# Altium schematic sheet Connectors.SchDoc
size 431 x 279 mm; SheetNumber: 1; SheetTotal: 1
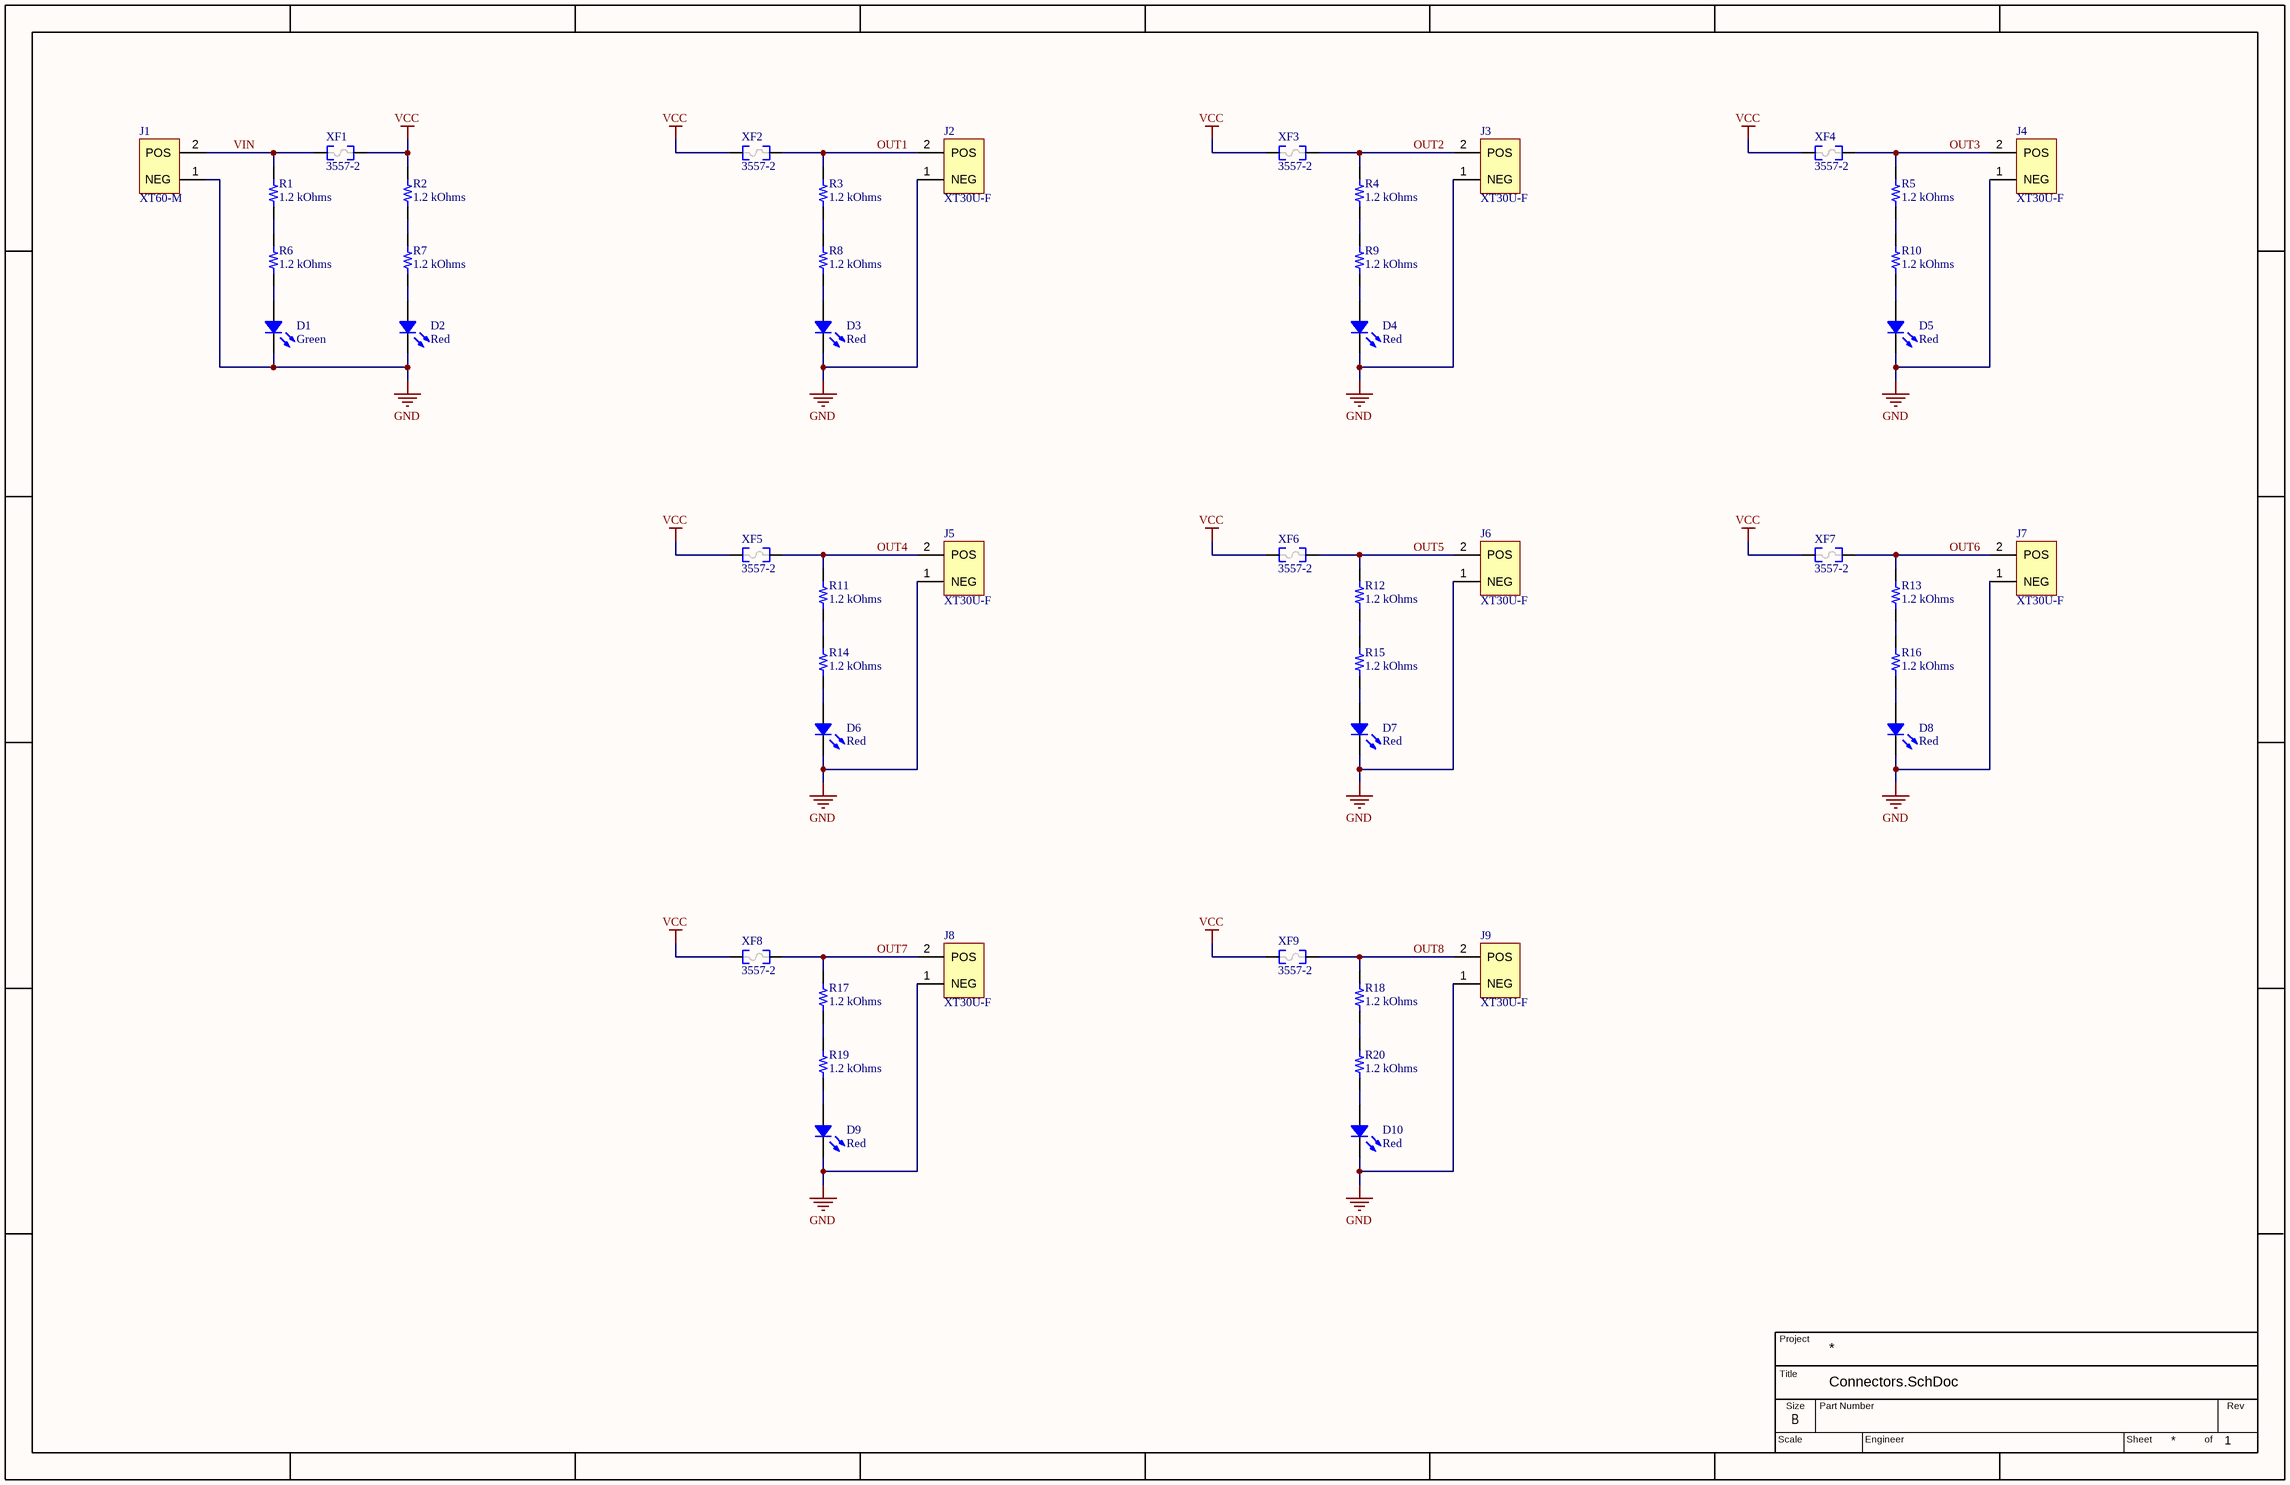
[diagram p0: Connectors.SchDoc]

## Parts
D1  Green  [LED 0603_1608 GREEN]
D2  Red  [LED 0603_1608 RED]
D3  Red  [LED 0603_1608 RED]
D4  Red  [LED 0603_1608 RED]
D5  Red  [LED 0603_1608 RED]
D6  Red  [LED 0603_1608 RED]
D7  Red  [LED 0603_1608 RED]
D8  Red  [LED 0603_1608 RED]
D9  Red  [LED 0603_1608 RED]
D10  Red  [LED 0603_1608 RED]
J1  XT60-M  [AMASS_XT60-M]
J2  XT30U-F  [AMASS_XT30-M]
J3  XT30U-F  [AMASS_XT30-M]
J4  XT30U-F  [AMASS_XT30-M]
J5  XT30U-F  [AMASS_XT30-M]
J6  XT30U-F  [AMASS_XT30-M]
J7  XT30U-F  [AMASS_XT30-M]
J8  XT30U-F  [AMASS_XT30-M]
J9  XT30U-F  [AMASS_XT30-M]
R1  1.2 kOhms  [RES 1210_3225]
R2  1.2 kOhms  [RES 1210_3225]
R3  1.2 kOhms  [RES 1210_3225]
R4  1.2 kOhms  [RES 1210_3225]
R5  1.2 kOhms  [RES 1210_3225]
R6  1.2 kOhms  [RES 1210_3225]
R7  1.2 kOhms  [RES 1210_3225]
R8  1.2 kOhms  [RES 1210_3225]
R9  1.2 kOhms  [RES 1210_3225]
R10  1.2 kOhms  [RES 1210_3225]
R11  1.2 kOhms  [RES 1210_3225]
R12  1.2 kOhms  [RES 1210_3225]
R13  1.2 kOhms  [RES 1210_3225]
R14  1.2 kOhms  [RES 1210_3225]
R15  1.2 kOhms  [RES 1210_3225]
R16  1.2 kOhms  [RES 1210_3225]
R17  1.2 kOhms  [RES 1210_3225]
R18  1.2 kOhms  [RES 1210_3225]
R19  1.2 kOhms  [RES 1210_3225]
R20  1.2 kOhms  [RES 1210_3225]
XF1  3557-2  [FUSE_3557-2]
XF2  3557-2  [FUSE_3557-2]
XF3  3557-2  [FUSE_3557-2]
XF4  3557-2  [FUSE_3557-2]
XF5  3557-2  [FUSE_3557-2]
XF6  3557-2  [FUSE_3557-2]
XF7  3557-2  [FUSE_3557-2]
XF8  3557-2  [FUSE_3557-2]
XF9  3557-2  [FUSE_3557-2]

## Nets
GND: D1.2 D2.2 D3.2 D4.2 D5.2 D6.2 D7.2 D8.2 D9.2 D10.2 J1.1(NEG) J2.1(NEG) J3.1(NEG) J4.1(NEG) J5.1(NEG) J6.1(NEG) J7.1(NEG) J8.1(NEG) J9.1(NEG)
VCC: R2.2 XF1.2 XF2.1 XF3.1 XF4.1 XF5.1 XF6.1 XF7.1 XF8.1 XF9.1
OUT1: J2.2(POS) R3.2 XF2.2
OUT2: J3.2(POS) R4.2 XF3.2
OUT3: J4.2(POS) R5.2 XF4.2
OUT4: J5.2(POS) R11.2 XF5.2
OUT5: J6.2(POS) R12.2 XF6.2
OUT6: J7.2(POS) R13.2 XF7.2
OUT7: J8.2(POS) R17.2 XF8.2
OUT8: J9.2(POS) R18.2 XF9.2
VIN: J1.2(POS) R1.2 XF1.1
NetD1_1: D1.1 R6.1
NetD2_1: D2.1 R7.1
NetD3_1: D3.1 R8.1
NetD4_1: D4.1 R9.1
NetD5_1: D5.1 R10.1
NetD6_1: D6.1 R14.1
NetD7_1: D7.1 R15.1
NetD8_1: D8.1 R16.1
NetD9_1: D9.1 R19.1
NetD10_1: D10.1 R20.1
NetR1_1: R1.1 R6.2
NetR2_1: R2.1 R7.2
NetR3_1: R3.1 R8.2
NetR4_1: R4.1 R9.2
NetR5_1: R5.1 R10.2
NetR11_1: R11.1 R14.2
NetR12_1: R12.1 R15.2
NetR13_1: R13.1 R16.2
NetR17_1: R17.1 R19.2
NetR18_1: R18.1 R20.2

## Notes on the sheet
- Title
- Project
- Scale
- Size
- B
- Part Number
- Engineer
- Sheet
- of
- Rev

## Library data of the parts
D1 = LTST-C193TGKT-5A: LED GREEN CLEAR CHIP SMD; Manufacturer: Lite-On Inc.; Configuration: Standard; Current - Test: 5mA; Lens Color: Colorless; Lens Size: 1.15mm x 0.80mm; Lens Style: Rectangle with Flat Top; Millicandela Rating: 154mcd; Viewing Angle: 130°; Voltage - Forward (Vf) (Typ): 2.8V; Wavelength - Dominant: 528nm; Wavelength - Peak: 525nm; Part Number: LTST-C193TGKT-5A; Color: Green; ComponentLink1Description: Datasheet; ComponentLink1URL: //media.digikey.com/pdf/Data%20Sheets/Lite-On%20PDFs/LTST-C193TGKT-5A.pdf; ComponentLink2Description: DigiKey Link; ComponentLink2URL: http://digikey.com/product-detail/en/lite-on-inc/LTST-C193TGKT-5A/160-1832-1-ND/2356255; Device Package: 0603 (1608 Metric); Height (Max): 0.45mm; LastUpdated: 9/2/2020 1:20:42 AM; Lens Transparency: Clear; Lifecycle Status: Active; Minimum Order: 1; Mounting Type: Surface Mount; Package / Case: 0603 (1608 Metric); Packaging: TapeAndReel; PartId: 644; Part Status: Active; Price: 0.10; Series: -; Size / Dimension: 1.60mm L x 0.80mm W; Supplier 1: DigiKey; Supplier Part Number 1: 160-1832-1-ND; Supplier Device Package: Chip LED; Value: Green
D2-D10 = 19-217/R6C-AL1M2VY/3T: LED RED CLEAR 2SMD; Manufacturer: Everlight Electronics Co Ltd; Configuration: Standard; Current - Test: 5mA; Lens Color: Colorless; Lens Size: 1.00mm x 0.80mm; Lens Style: Rectangle with Flat Top; Viewing Angle: 120°; Voltage - Forward (Vf) (Typ): 1.95V; Wavelength - Peak: 632nm; Part Number: 19-217/R6C-AL1M2VY/3T; Color: Red; ComponentLink1Description: Datasheet; ComponentLink1URL: //media.digikey.com/pdf/Data%20Sheets/Everlight%20PDFs/19-217-R6C-AL1M2VY-3T.pdf; ComponentLink2Description: DigiKey Link; ComponentLink2URL: http://digikey.com/product-detail/en/everlight-electronics-co-ltd/19-217-R6C-AL1M2VY-3T/1080-1585-1-ND/8535308; Device Package: 0603 (1608 Metric); Height (Max): 0.50mm; LastUpdated: 9/2/2020 1:20:56 AM; Lens Transparency: Clear; Lifecycle Status: Active; Minimum Order: 1; Mounting Type: Surface Mount; Package / Case: 0603 (1608 Metric); Packaging: TapeAndReel; PartId: 419; Part Status: Active; Price: 0.05; Series: -; Size / Dimension: 1.60mm L x 0.80mm W; Supplier 1: DigiKey; Supplier Part Number 1: 1080-1585-1-ND; Supplier Device Package: 2-SMD; Value: Red
J1 = XT60-M: Plug; DC supply; XT60; male; PIN: 2; for cable; soldered; 30A; 500V; MF: AMASS; MP: XT60-M; Price: None; Package: Package Analog Devices; Value: *; Availability: Unavailable; SnapEDA_Link: https://www.snapeda.com/parts/XT60-M/AMASS/view-part/2883912/?ref=snap
J2-J9 = XT30U-F: Plug; DC supply; XT30; female; PIN: 2; for cable; soldering; 15A; MP: XT60-M; MF: AMASS; Price: None; Package: Package Analog Devices; Value: *; Availability: Unavailable; SnapEDA_Link: https://www.snapeda.com/parts/XT60-M/AMASS/view-part/2883912/?ref=snap
R1-R20 = ERJ-14YJ122U: RES SMD 1.2K OHM 5% 1/2W 1210; Manufacturer: Panasonic Electronic Components; Power (Watts): 0.5W, 1/2W; Temperature Coefficient: ±200ppm/°C; Part Number: ERJ-14YJ122U; ComponentLink1Description: Datasheet; ComponentLink1URL: https://b2b-api.panasonic.eu/file_stream/pids/fileversion/1242; ComponentLink2Description: DigiKey Link; ComponentLink2URL: http://digikey.com/product-detail/en/panasonic-electronic-components/ERJ-14YJ122U/P1.2KVDKR-ND/1808556; Composition: Thick Film; Device Package: 1210 (3225 Metric); Features: Automotive AEC-Q200; Height - Seated (Max): 0.028" (0.70mm); LastUpdated: 9/2/2020 1:26:24 AM; Lifecycle Status: Active; Minimum Order: 1; Number of Terminations: 2; Operating Temperature: -55°C ~ 155°C; Package / Case: 1210 (3225 Metric); Packaging: TapeAndReel; Part Status: Active; Price: 0.02; Ratings: AEC-Q200; Resistance: 1.2 kOhms; Series: ERJ; Size / Dimension: 0.126" L x 0.098" W (3.20mm x 2.50mm); Supplier 1: DigiKey; Supplier Part Number 1: P1.2KVDKR-ND; Supplier Device Package: 1210; Tolerance: ±5%; Value: 1.2 kOhms
XF1-XF9 = 3557-2: Fuse Block 30A 500V 1 Circuit Blade Through Hole; MF: Keystone Electronics; Package: Nonstandard Keystone; Value: *; Price: None; MP: 3557-2; SnapEDA_Link: https://www.snapeda.com/parts/3557-2/Keystone%20Electronics/view-part/278060/?ref=snap; Availability: Unavailable